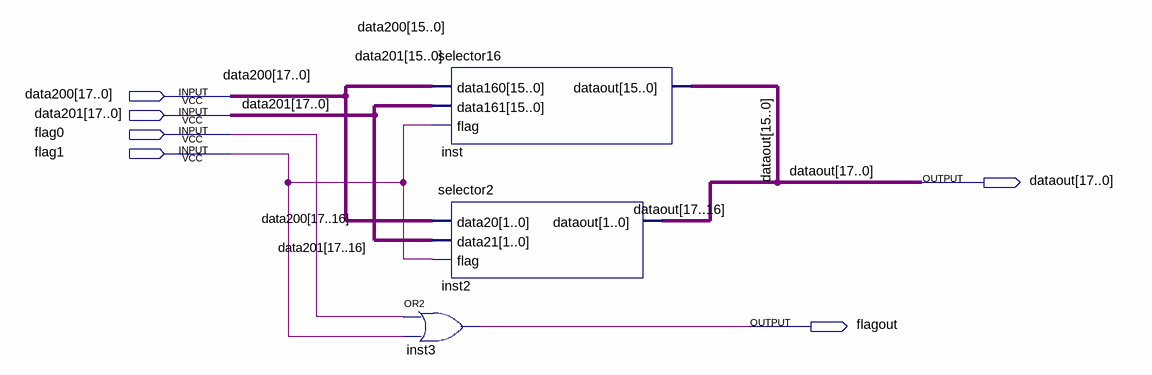
[diagram p0: schematic sheet]
// Quartus schematic selector18.bdf as structural Verilog: 3 symbols, 6 pins
module selector18 (
  input  [17:0] data200,
  input  [17:0] data201,
  input  flag0,
  input  flag1,
  output [17:0] dataout,
  output flagout
);

  or inst3 (flagout, flag0, flag1);
  selector16 inst (.data160(data200[15:0]), .data161(data201[15:0]), .flag(flag1), .dataout(dataout[15:0]));
  selector2 inst2 (.data20(data200[17:16]), .data21(data201[17:16]), .flag(flag1), .dataout(dataout[17:16]));
endmodule
